# EAGLE design z80sim_pio_3_board2_v2 (EAGLE 9.6.2)

## Sheet 1 of 2
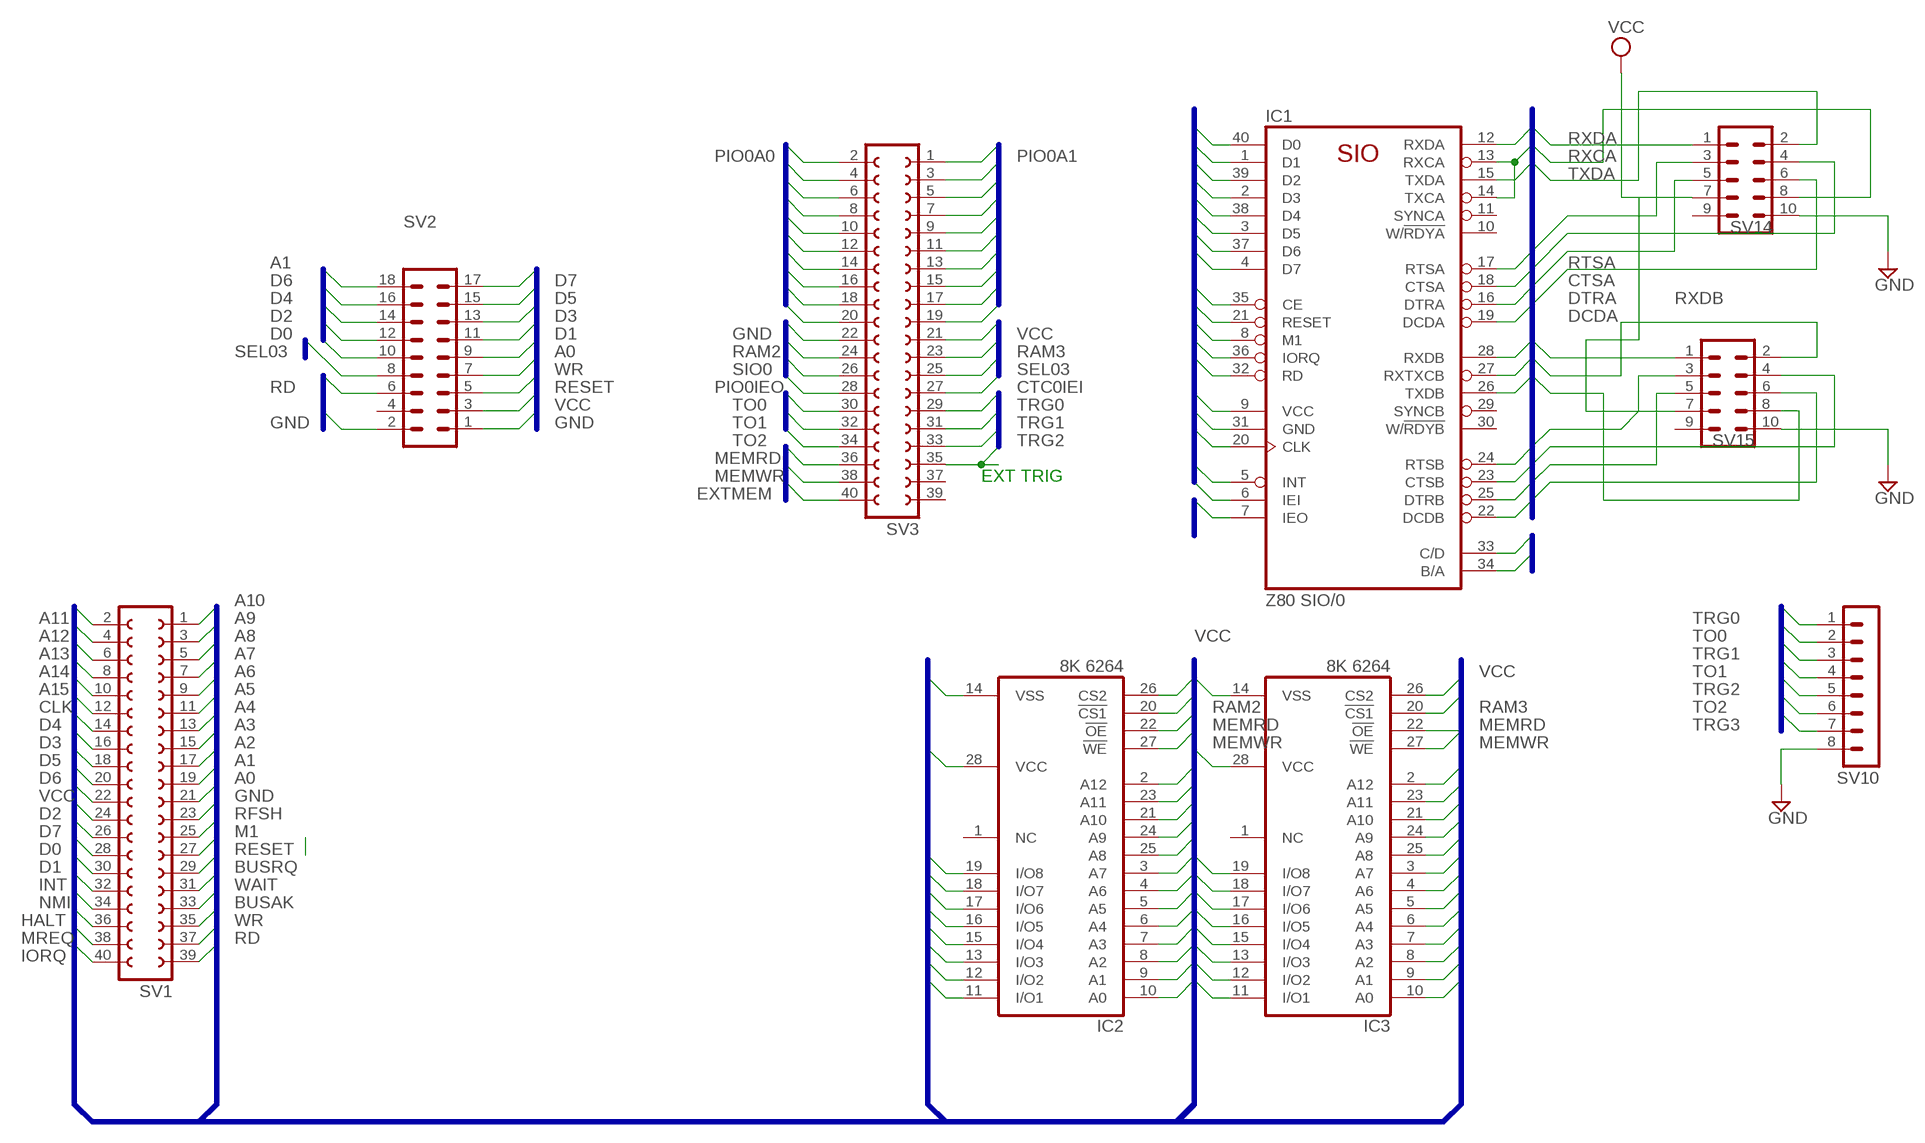
[diagram p0: schematic, sheet 1]

### Parts
IC1  Z80 SIO/0  Z80SIO  [DIL40]
IC2  8K 6264  6264A  [DIL28-6]
IC3  8K 6264  6264A  [DIL28-6]
SV1  FE20-2  [FE20-2]
SV2  MA09-2  [MA09-2]
SV3  FE20-2  [FE20-2]
SV10  MA08-1  [MA08-1]
SV14  MA05-2  [MA05-2]
SV15  MA05-2  [MA05-2]

### Nets
A0: IC1.34(B/A) IC2.10(A0) IC3.10(A0) SV1.21 SV2.9
A1: IC1.33(C/D) IC2.9(A1) IC3.9(A1) SV1.19 SV2.18
A2: IC2.8(A2) IC3.8(A2) SV1.17
A3: IC2.7(A3) IC3.7(A3) SV1.15
A4: IC2.6(A4) IC3.6(A4) SV1.13
A5: IC2.5(A5) IC3.5(A5) SV1.11
A6: IC2.4(A6) IC3.4(A6) SV1.9
A7: IC2.3(A7) IC3.3(A7) SV1.7
A8: IC2.25(A8) IC3.25(A8) SV1.5
A9: IC2.24(A9) IC3.24(A9) SV1.3
A10: IC2.21(A10) IC3.21(A10) SV1.1
A11: IC2.23(A11) IC3.23(A11) SV1.2
A12: IC2.2(A12) IC3.2(A12) SV1.4
A13: SV1.6
A14: SV1.8
A15: SV1.10
BUSAK: SV1.35
BUSRQ: SV1.31
CLK: IC1.20(CLK) SV1.12
CTC0IEI: IC1.7(IEO) SV3.27 ; also sheet 2
CTSA: IC1.18(CTSA) SV14.4
CTSB: IC1.23(CTSB) SV15.4
D0: IC1.40(D0) IC2.11(I/O1) IC3.11(I/O1) SV1.28 SV2.10
D1: IC1.1(D1) IC2.12(I/O2) IC3.12(I/O2) SV1.30 SV2.11
D2: IC1.39(D2) IC2.13(I/O3) IC3.13(I/O3) SV1.24 SV2.12
D3: IC1.2(D3) IC2.15(I/O4) IC3.15(I/O4) SV1.16 SV2.13
D4: IC1.38(D4) IC2.16(I/O5) IC3.16(I/O5) SV1.14 SV2.14
D5: IC1.3(D5) IC2.17(I/O6) IC3.17(I/O6) SV1.18 SV2.15
D6: IC1.37(D6) IC2.18(I/O7) IC3.18(I/O7) SV1.20 SV2.16
D7: IC1.4(D7) IC2.19(I/O8) IC3.19(I/O8) SV1.26 SV2.17
DCDA: IC1.19(DCDA) SV14.6
DCDB: IC1.22(DCDB) SV15.6
DTRA: IC1.16(DTRA) SV14.5
DTRB: IC1.25(DTRB) SV15.5
EXTMEM: SV3.40
GND: IC1.31(GND) IC2.14(VSS) IC3.14(VSS) SV1.23 SV2.1 SV2.2 SV3.22 SV10.8 SV14.10 SV15.10 ; also sheet 2
HALT: SV1.36
INT: IC1.5(INT) SV1.32
IORQ: IC1.36(IORQ) SV1.40
M1: IC1.8(M1) SV1.27
MEMRD: IC2.22(!OE) IC3.22(!OE) SV3.36
MEMWR: IC2.27(!WE) IC3.27(!WE) SV3.38
MREQ: SV1.38
NMI: SV1.34
PIO0A0: SV3.2 ; also sheet 2
PIO0A1: SV3.1 ; also sheet 2
PIO0A2: SV3.4 ; also sheet 2
PIO0A3: SV3.3 ; also sheet 2
PIO0A4: SV3.6 ; also sheet 2
PIO0A5: SV3.5 ; also sheet 2
PIO0A6: SV3.8 ; also sheet 2
PIO0A7: SV3.7 ; also sheet 2
PIO0ARDY: SV3.10 ; also sheet 2
PIO0ASTB: SV3.9 ; also sheet 2
PIO0B0: SV3.12 ; also sheet 2
PIO0B1: SV3.11 ; also sheet 2
PIO0B2: SV3.14 ; also sheet 2
PIO0B3: SV3.13 ; also sheet 2
PIO0B4: SV3.16 ; also sheet 2
PIO0B5: SV3.15 ; also sheet 2
PIO0B6: SV3.18 ; also sheet 2
PIO0B7: SV3.17 ; also sheet 2
PIO0BRDY: SV3.20 ; also sheet 2
PIO0BSTB: SV3.19 ; also sheet 2
PIO0IEO: SV3.28
RAM2: IC2.20(!CS1) SV3.24
RAM3: IC3.20(!CS1) SV3.23
RD: IC1.32(RD) SV1.39 SV2.6
RESET: IC1.21(RESET) SV1.29 SV2.5
RFSH: SV1.25
RTSA: IC1.17(RTSA) SV14.3
RTSB: IC1.24(RTSB) SV15.3
RXCA: IC1.13(RXCA) IC1.14(TXCA) SV14.8 ; also sheet 2
RXDA: IC1.12(RXDA) SV14.1
RXDB: IC1.28(RXDB) SV15.1
RXTXCB: IC1.27(RXTXCB) SV15.8 ; also sheet 2
SEL03: SV2.8 SV3.25
SIO0: IC1.35(CE) SV3.26
TO0: SV3.30 SV10.2 ; also sheet 2
TO1: SV3.32 SV10.4 ; also sheet 2
TO2: SV3.34 SV10.6
TRG0: SV3.29 SV10.1
TRG1: SV3.31 SV10.3
TRG2: SV3.33 SV10.5
TRG3: SV3.35 SV10.7
TXDA: IC1.15(TXDA) SV14.2
TXDB: IC1.26(TXDB) SV15.2
VCC: IC1.6(IEI) IC1.9(VCC) IC2.26(CS2) IC2.28(VCC) IC3.26(CS2) IC3.28(VCC) SV1.22 SV2.3 SV3.21 SV14.7 SV15.7 ; also sheet 2
WAIT: SV1.33
WR: SV1.37 SV2.7
Unconnected: IC1.10(W/!RDYA) IC1.11(SYNCA) IC1.29(SYNCB) IC1.30(W/!RDYB) IC2.1(NC) IC3.1(NC) SV2.4 SV3.37 SV3.39 SV14.9 SV15.9

### Buses
M1,MREQ,IORQ,RD,WR,RFSH,HALT,WAIT,INT,NMI,RESET,BUSRQ,BUSAK,CLK,GND,VCC,A[0..15],D[0..7],MEMRD,MEMWR,IORD,IOWR,ROM0,RAM1,RAM2,RAM3,PIO0,CTC0,CTC0IEO,PIO0IEO,SIO0,SIO0IEO,SEL03,32K_SEL,ALT_BOOT
CTC0TO0,CTC0TO1,CTC0TO2,CTC0TRG0,CTC0TRG1,CTC0TRG2,CTC0TRG3,PIO0A0,PIO0A1,PIO0A2,PIO0A3,PIO0A4,PIO0A5,PIO0A6,PIO0A7,PIO0ARDY,PIO0ASTB,PIO0B0,PIO0B1,PIO0B2,PIO0B3,PIO0B4,PIO0B5,PIO0B6,PIO0B7,PIO0BRDY,PIO0BSTB
M1,MREQ,IORQ,RD,WR,RFSH,HALT,WAIT,INT,NMI,RESET,BUSRQ,BUSAK,CLK,GND,VCC,A[0..15],D[0..7],MEMRD,MEMWR,IORD,IOWR,ROM0,RAM1,RAM2,RAM3,PIO0,CTC0,CTC0IEO,CTC0IEI,PIO0IEO,SIO0,SEL03,EXTMEM
TRG0,TO0,TRG1,TO1,TRG2,TO2,TRG3
RXDA,RXCA,TXDA,TXCA,RTSA,CTSA,DTRA,DCDA,RXDB,RXTXCB,TXDB,RTSB,CTSB,DTRB,DCDB

### Notes on the sheet
- EXT TRIG

## Sheet 2 of 2
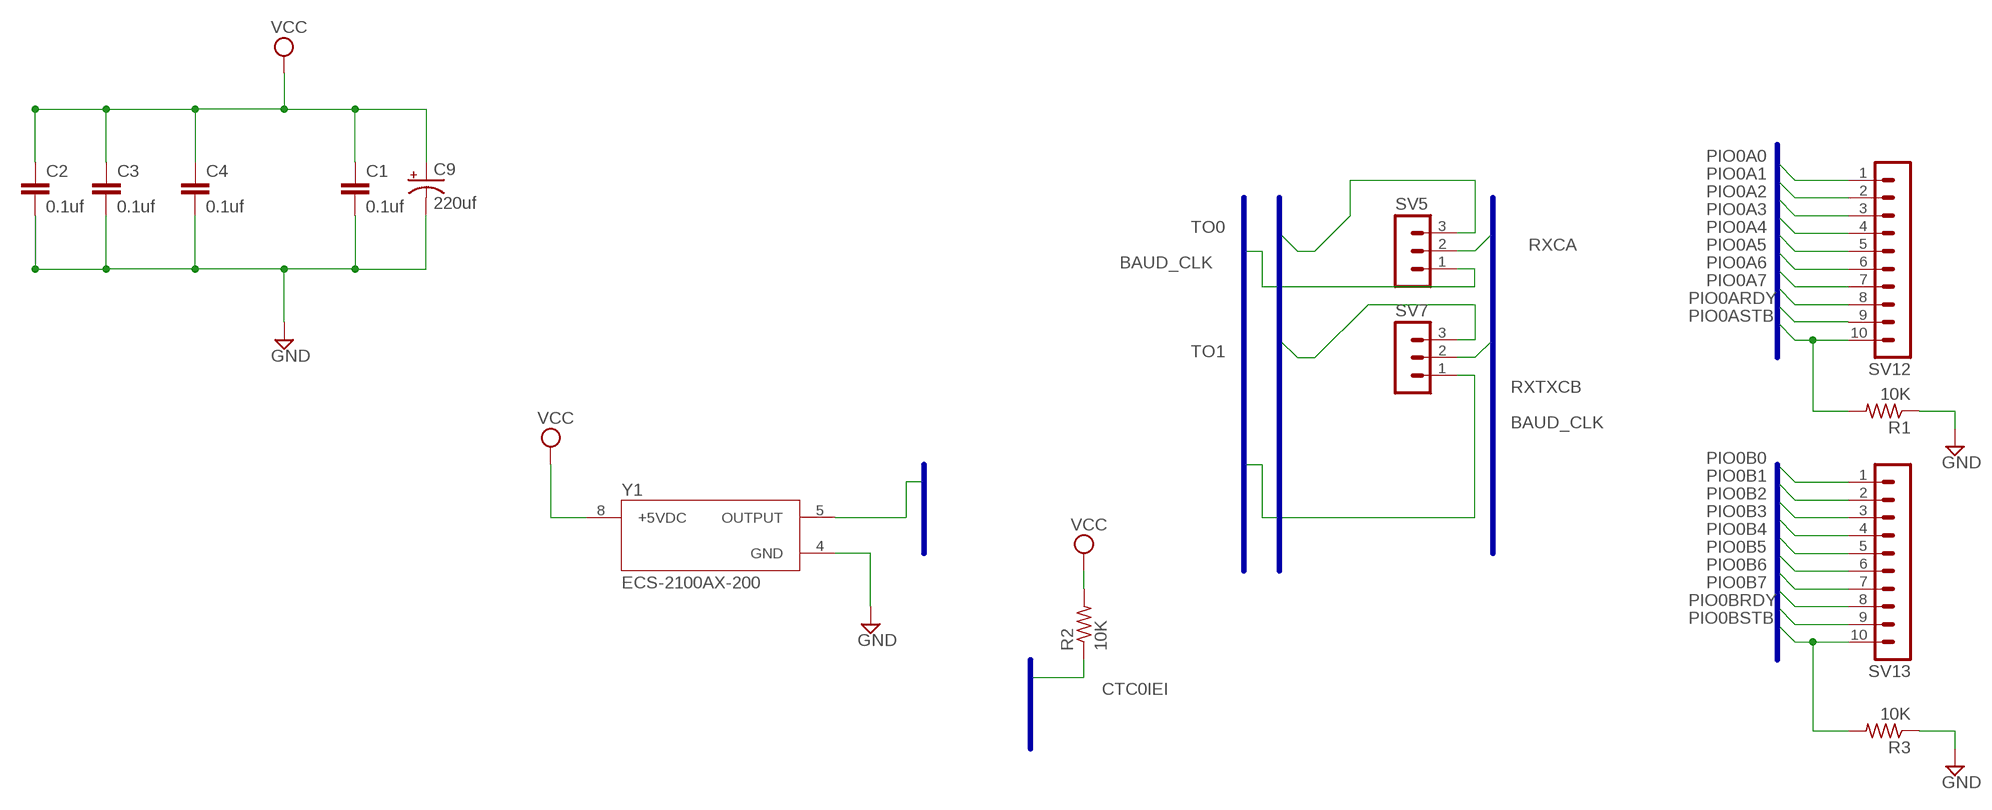
[diagram p1: schematic, sheet 2]

### Parts
C1  0.1uf  C5/3  [C5B3]
C2  0.1uf  C5/3  [C5B3]
C3  0.1uf  C5/3  [C5B3]
C4  0.1uf  C5/3  [C5B3]
C9  220uf  CPOL-USE3.5-10  [E3,5-10]
R1  10K  R-US_0204/7  [0204/7]
R2  10K  R-US_0204/7  [0204/7]
R3  10K  R-US_0204/7  [0204/7]
SV5  MA03-1  [MA03-1]
SV7  MA03-1  [MA03-1]
SV12  MA10-1  [MA10-1]
SV13  MA10-1  [MA10-1]
Y1  ECS-2100AX-200  [ECS-2100AX-200]

### Nets
BAUD_CLK: SV5.1 SV7.1 Y1.5(OUTPUT)
CTC0IEI: R2.1 ; also sheet 1
GND: C1.2 C2.2 C3.2 C4.2 C9.- R1.1 R3.1 Y1.4(GND) ; also sheet 1
PIO0A0: SV12.1 ; also sheet 1
PIO0A1: SV12.2 ; also sheet 1
PIO0A2: SV12.3 ; also sheet 1
PIO0A3: SV12.4 ; also sheet 1
PIO0A4: SV12.5 ; also sheet 1
PIO0A5: SV12.6 ; also sheet 1
PIO0A6: SV12.7 ; also sheet 1
PIO0A7: SV12.8 ; also sheet 1
PIO0ARDY: SV12.9 ; also sheet 1
PIO0ASTB: R1.2 SV12.10 ; also sheet 1
PIO0B0: SV13.1 ; also sheet 1
PIO0B1: SV13.2 ; also sheet 1
PIO0B2: SV13.3 ; also sheet 1
PIO0B3: SV13.4 ; also sheet 1
PIO0B4: SV13.5 ; also sheet 1
PIO0B5: SV13.6 ; also sheet 1
PIO0B6: SV13.7 ; also sheet 1
PIO0B7: SV13.8 ; also sheet 1
PIO0BRDY: SV13.9 ; also sheet 1
PIO0BSTB: R3.2 SV13.10 ; also sheet 1
RXCA: SV5.2 ; also sheet 1
RXTXCB: SV7.2 ; also sheet 1
TO0: SV5.3 ; also sheet 1
TO1: SV7.3 ; also sheet 1
VCC: C1.1 C2.1 C3.1 C4.1 C9.+ R2.2 Y1.8(+5VDC) ; also sheet 1

### Buses
32K_SEL,A[0..15],ALT_BOOT,BAUD_CLK,BUSAK,BUSRQ,CLK,CTC0,CTC0IEO,D[0..7],EXTMEM,GND,HALT,INT,IORD,IORQ,IOWR,M1,MEMRD,MEMWR,MREQ,NMI,PIO0,PIO0A0,PIO0A1,PIO0A2,PIO0A3,PIO0A4,PIO0A5,PIO0A6,PIO0A7,PIO0ARDY,PIO0ASTB,PIO0B0,PIO0B1,PIO0B2,PIO0B3,PIO0B4,PIO0B5,PIO0B6,PIO0B7,PIO0BRDY,PIO0BSTB,PIO0IEO,RAM1,RAM2,RAM3,RD,RESET,RFSH,ROM0,SEL03,SIO0,SIO0IEO,VCC,WAIT,WR
M1,MREQ,IORQ,RD,WR,RFSH,HALT,WAIT,INT,NMI,RESET,BUSRQ,BUSAK,CLK,GND,VCC,A[0..15],D[0..7],MEMRD,MEMWR,IORD,IOWR,ROM0,RAM1,RAM2,RAM3,PIO0,CTC0,CTC0IEO,CTC0IEI,PIO0IEO,SIO0,SEL03,EXTMEM
TRG0,TO0,TRG1,TO1,TRG2,TO2,TRG3
RXDA,RXCA,TXDA,TXCA,RTSA,CTSA,DTRA,DCDA,RXDB,RXTXCB,TXDB,RTSB,CTSB,DTRB,DCDB

## Library data of the parts
C1-C4 = capacitor-wima:C: CAPACITOR naming: grid - package width
C9 = rcl:CPOL-US: POLARIZED CAPACITOR, American symbol
IC1 = zilog:Z80SIO: Z80 FAMILY DEVICE
IC2 IC3 = memory-hitachi:6264A: MEMORY; OC_FARNELL: 283605; OC_NEWARK: unknown
R1-R3 = resistor:R-US_: RESISTOR, American symbol
SV1 SV3 = con-lsta:FE20-2: FEMALE HEADER; OC_FARNELL: unknown; OC_NEWARK: unknown
SV2 = con-lstb:MA09-2: PIN HEADER; OC_FARNELL: unknown; OC_NEWARK: unknown
SV5 SV7 = con-lstb:MA03-1: PIN HEADER; OC_FARNELL: unknown; OC_NEWARK: unknown
SV10 = con-lstb:MA08-1: PIN HEADER; OC_FARNELL: unknown; OC_NEWARK: unknown
SV12 SV13 = con-lstb:MA10-1: PIN HEADER; OC_FARNELL: unknown; OC_NEWARK: unknown
SV14 SV15 = con-lstb:MA05-2: PIN HEADER; OC_FARNELL: unknown; OC_NEWARK: unknown
Y1 = Crystals_Oscillators:ECS-2100AX-200: XTAL OSC XO 20.0000MHZ HCMOS TTL Manufacturer's datasheet <https://ecsxtal.com/store/pdf/ecs-2100x.pdf>; CREATED_BY: PCBLayout.com; DIGIKEY_PART_NUMBER: X964-ND; MANUFACTURER: ECS Inc.; MPN: ECS-2100AX-200; PACKAGE: 8-DIP

## Board
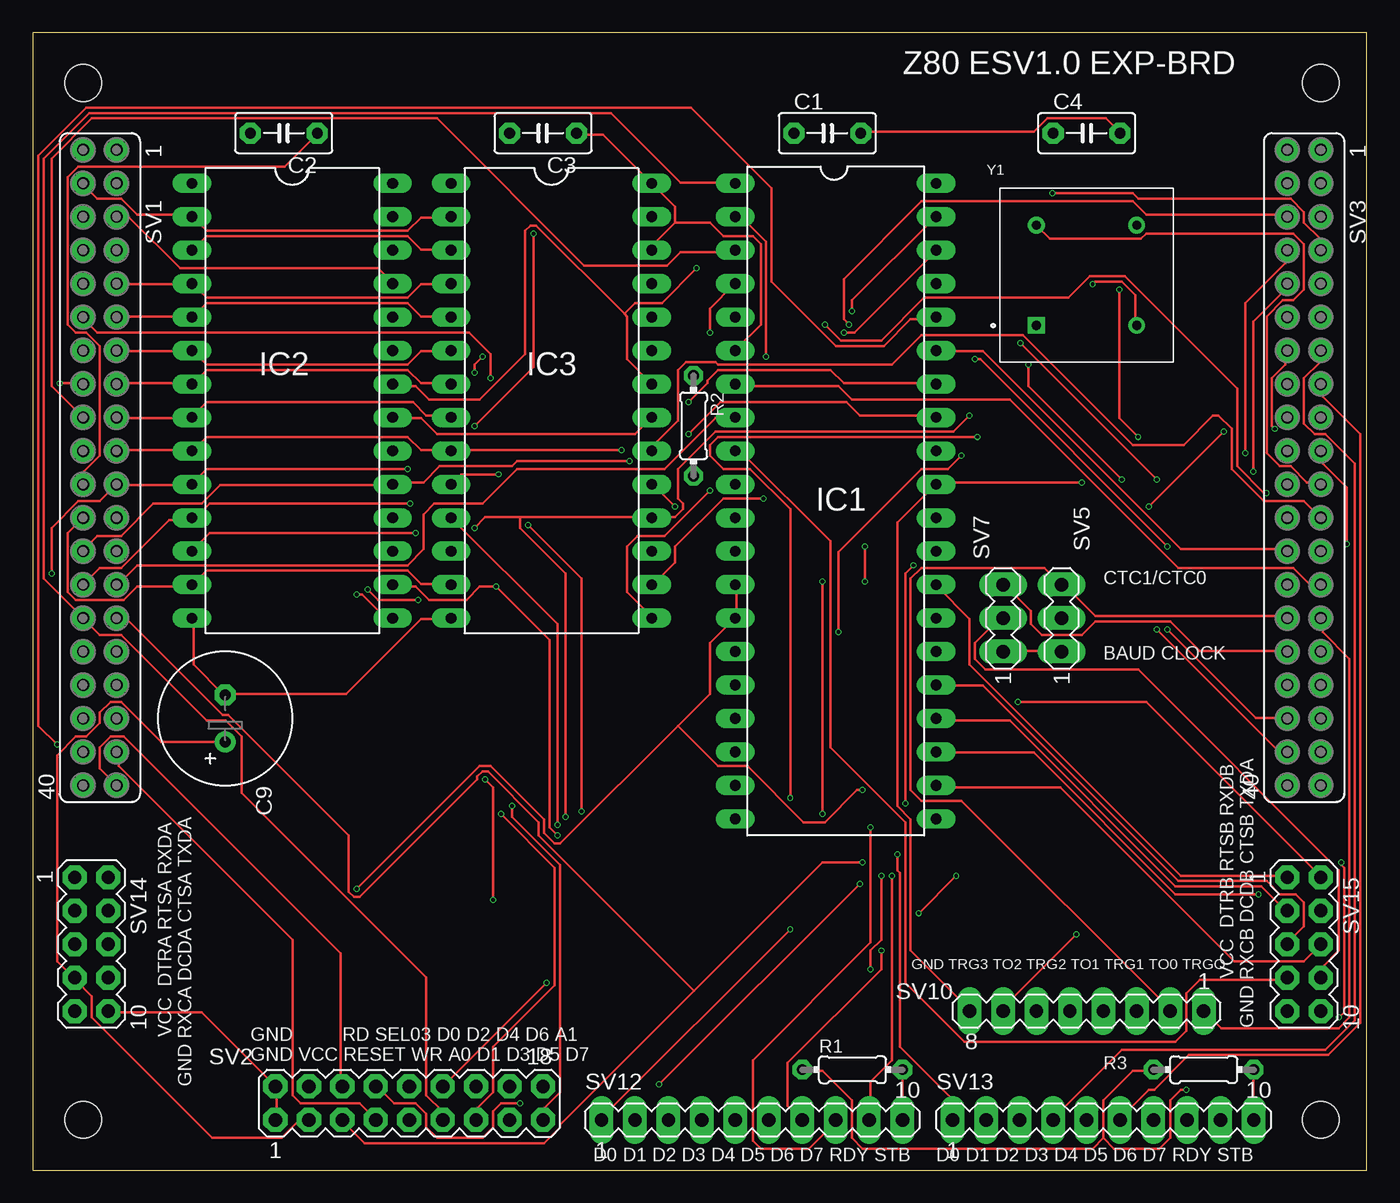
[diagram p2: board, top side]
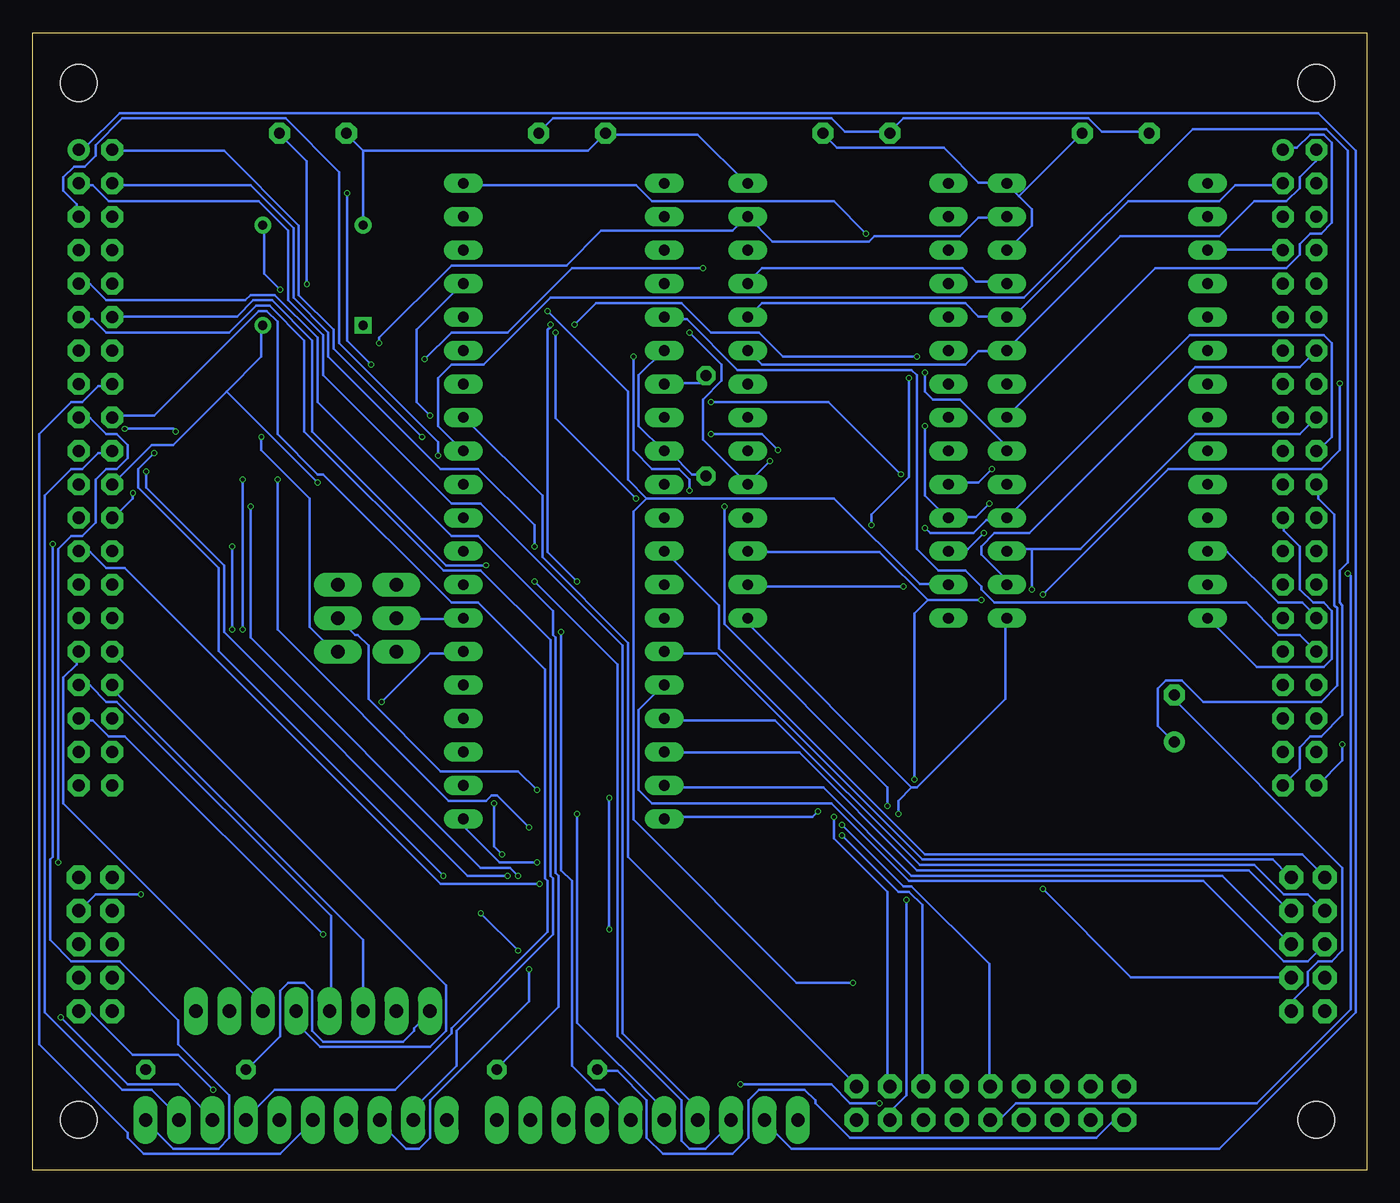
[diagram p3: board, bottom side, seen from below]

Size 101.27 x 86.35 mm. Coordinates in mm from the lower left corner, seen from the top.
Outline: 0,0 101.27,0 101.27,86.35 0,86.35 0,0
Copper layers (1*16): Top 0.035mm / dielectric 1.6mm / Bottom 0.035mm
Design rules "jlcpcb-2layers *": minimum track width 8mil, minimum drill 0.3mm, track to track 8mil, track to pad 8mil, pad to pad 8mil, via to via 8mil, smd to smd 5mil, copper to edge 0.3mm, drill to drill 8mil, minimum pad ring 10mil, minimum via ring 3mil, stop-mask expansion 4mil, vias tented up to drill 0mil, thermal gap 10mil
Holes 2.8 mm at 3.81,82.55 97.79,82.55 97.79,3.81 3.81,3.81

### Footprints (pad centres in the part's own frame; a part is rotated, then mirrored left to right if it is on the bottom)
C5B3 = drill 0.813 pad 1.6 octagon: 1 -2.54,0; 2 2.54,0
E3,5-10 = drill 0.813 pad 1.6: + -1.778,0 | drill 0.813 pad 1.6 octagon: - 1.778,0
DIL40 = drill 0.813 long: 1 -24.13,-7.62; 2 -21.59,-7.62; 3 -19.05,-7.62; 4 -16.51,-7.62; 5 -13.97,-7.62; 6 -11.43,-7.62; 7 -8.89,-7.62; 8 -6.35,-7.62; 9 -3.81,-7.62; 10 -1.27,-7.62; 11 1.27,-7.62; 12 3.81,-7.62; 13 6.35,-7.62; 14 8.89,-7.62; 15 11.43,-7.62; 16 13.97,-7.62; 17 16.51,-7.62; 18 19.05,-7.62; 19 21.59,-7.62; 20 24.13,-7.62; 21 24.13,7.62; 22 21.59,7.62; 23 19.05,7.62; 24 16.51,7.62; 25 13.97,7.62; 26 11.43,7.62; 27 8.89,7.62; 28 6.35,7.62; 29 3.81,7.62; 30 1.27,7.62; 31 -1.27,7.62; 32 -3.81,7.62; 33 -6.35,7.62; 34 -8.89,7.62; 35 -11.43,7.62; 36 -13.97,7.62; 37 -16.51,7.62; 38 -19.05,7.62; 39 -21.59,7.62; 40 -24.13,7.62
DIL28-6 = drill 0.813 long: 1 -16.51,-7.62; 2 -13.97,-7.62; 3 -11.43,-7.62; 4 -8.89,-7.62; 5 -6.35,-7.62; 6 -3.81,-7.62; 7 -1.27,-7.62; 8 1.27,-7.62; 9 3.81,-7.62; 10 6.35,-7.62; 11 8.89,-7.62; 12 11.43,-7.62; 13 13.97,-7.62; 14 16.51,-7.62; 15 16.51,7.62; 16 13.97,7.62; 17 11.43,7.62; 18 8.89,7.62; 19 6.35,7.62; 20 3.81,7.62; 21 1.27,7.62; 22 -1.27,7.62; 23 -3.81,7.62; 24 -6.35,7.62; 25 -8.89,7.62; 26 -11.43,7.62; 27 -13.97,7.62; 28 -16.51,7.62
0204/7 = drill 0.813 octagon: 1 -3.81,0; 2 3.81,0
FE20-2 = drill 0.914: 1 -24.13,1.27 | drill 0.914 octagon: 2 -24.13,-1.27; 3 -21.59,1.27; 4 -21.59,-1.27; 5 -19.05,1.27; 6 -19.05,-1.27; 7 -16.51,1.27; 8 -16.51,-1.27; 9 -13.97,1.27; 10 -13.97,-1.27; 11 -11.43,1.27; 12 -11.43,-1.27; 13 -8.89,1.27; 14 -8.89,-1.27; 15 -6.35,1.27; 16 -6.35,-1.27; 17 -3.81,1.27; 18 -3.81,-1.27; 19 -1.27,1.27; 20 -1.27,-1.27; 21 1.27,1.27; 22 1.27,-1.27; 23 3.81,1.27; 24 3.81,-1.27; 25 6.35,1.27; 26 6.35,-1.27; 27 8.89,1.27; 28 8.89,-1.27; 29 11.43,1.27; 30 11.43,-1.27; 31 13.97,1.27; 32 13.97,-1.27; 33 16.51,1.27; 34 16.51,-1.27; 35 19.05,1.27; 36 19.05,-1.27; 37 21.59,1.27; 38 21.59,-1.27; 39 24.13,1.27; 40 24.13,-1.27
MA09-2 = drill 1.016 octagon: 1 -10.16,-1.27; 2 -10.16,1.27; 3 -7.62,-1.27; 4 -7.62,1.27; 5 -5.08,-1.27; 6 -5.08,1.27; 7 -2.54,-1.27; 8 -2.54,1.27; 9 0,-1.27; 10 0,1.27; 11 2.54,-1.27; 12 2.54,1.27; 13 5.08,-1.27; 14 5.08,1.27; 15 7.62,-1.27; 16 7.62,1.27; 17 10.16,-1.27; 18 10.16,1.27
MA03-1 = drill 1.016 long: 1 -2.54,0; 2 0,0; 3 2.54,0
MA08-1 = drill 1.016 long: 1 -8.89,0; 2 -6.35,0; 3 -3.81,0; 4 -1.27,0; 5 1.27,0; 6 3.81,0; 7 6.35,0; 8 8.89,0
MA10-1 = drill 1.016 long: 1 -11.43,0; 2 -8.89,0; 3 -6.35,0; 4 -3.81,0; 5 -1.27,0; 6 1.27,0; 7 3.81,0; 8 6.35,0; 9 8.89,0; 10 11.43,0
MA05-2 = drill 1.016 octagon: 1 -5.08,-1.27; 2 -5.08,1.27; 3 -2.54,-1.27; 4 -2.54,1.27; 5 0,-1.27; 6 0,1.27; 7 2.54,-1.27; 8 2.54,1.27; 9 5.08,-1.27; 10 5.08,1.27
ECS-2100AX-200 = drill 0.7 square: 1 -3.81,-3.81 | drill 0.7: 4 3.81,-3.81; 5 3.81,3.81; 8 -3.81,3.81

### Placement (x,y rotation side)
C1  60.33,78.74 0 top
C2  19.05,78.74 180 top
C3  38.73,78.74 180 top
C4  80.01,78.74 0 top
C9  14.61,34.29 90 top
IC1  60.96,50.8 270 top
IC2  19.68,58.42 270 top
IC3  39.37,58.42 270 top
R1  62.23,7.62 0 top
R2  50.16,56.52 270 top
R3  88.9,7.62 0 top
SV1  5.08,53.34 270 top
SV2  28.57,5.08 0 top
SV3  96.52,53.34 270 top
SV5  78.11,41.91 90 top
SV7  73.66,41.91 90 top
SV10  80.01,12.06 180 top
SV12  54.61,3.81 0 top
SV13  81.28,3.81 0 top
SV14  4.45,17.14 270 top
SV15  96.52,17.14 270 top
Y1  80.01,67.94 0 top

### Tracks (layer width: path | path; a pad name or v marks a point on that pad's centre or on a via)
A0  (via drill 0.3)
  Top 0.203: v28.45,53.24 13.21,53.24 12.19,52.22 IC2.10 11.99,52.02 6.5,52.02 SV1.21 5.08,50.8 3.45,50.8 1.42,48.77 v1.42,45.31 | v49.78,58.32 51.21,59.74 51.21,59.94 52.02,60.76 60.55,60.76 61.57,59.74 68.48,59.74 IC1.34 | v35.36,52.83 32.51,52.83 IC3.10
  Bottom 0.203: v28.45,53.24 29.46,52.22 31.7,52.22 IC3.10 | v49.78,58.32 40.84,58.32 v35.36,52.83 | v1.42,45.31 1.22,45.11 1.22,12.19 8.33,5.08 26.62,5.08 27.84,3.86 28.45,3.86 SV2.9
A1  (via drill 0.3)
  Top 0.203: SV1.19 6.5,54.66 11.99,54.66 IC2.9 12.19,54.66 13.21,55.68 28.45,55.68 29.46,54.66 31.7,54.66 IC3.9 31.9,54.66 v44.7,54.66 | v49.78,55.88 52.22,58.32 61.77,58.32 62.79,57.3 68.48,57.3 IC1.33
  Bottom 0.203: IC1.33 68.48,57.1 62.59,51.21 62.59,46.53 56.08,40.03 56.08,23.77 38.81,6.5 SV2.18 | v44.7,54.66 45.92,55.88 v49.78,55.88
A2
  Top 0.203: SV1.17 6.5,57.1 11.99,57.1 IC2.8 12.19,57.3 13.21,58.32 28.85,58.32 29.87,57.3 31.7,57.3 IC3.8
A3
  Top 0.203: SV1.15 6.5,59.74 11.99,59.74 IC2.7 12.19,59.74 13.21,60.76 28.45,60.76 29.46,59.74 31.7,59.74 IC3.7
A4
  Top 0.203: SV1.13 6.5,62.18 11.99,62.18 IC2.6 12.19,62.18 13.21,61.16 28.45,61.16 29.46,62.18 31.7,62.18 IC3.6
A5
  Top 0.203: SV1.11 6.5,64.82 11.99,64.82 IC2.5 12.19,64.82 13.21,65.84 28.45,65.84 29.46,64.82 31.7,64.82 IC3.5
A6
  Top 0.203: SV1.9 6.5,67.26 11.99,67.26 IC2.4 12.19,67.26 13.21,66.24 28.45,66.24 29.46,67.26 31.7,67.26 IC3.4
A7
  Top 0.203: IC3.3 31.7,69.9 29.46,69.9 28.45,70.92 13.21,70.92 12.19,69.9 IC2.3
  Bottom 0.203: IC2.3 11.99,69.9 6.5,69.9 SV1.7
A8
  Top 0.203: SV1.5 6.5,72.34 7.32,72.34 11.18,68.48 26.21,68.48 27.23,67.46 IC2.25
  Bottom 0.203: IC2.25 27.43,67.46 29.67,67.46 30.68,68.48 45.92,68.48 46.94,67.46 IC3.25
A9
  Bottom 0.203: IC3.24 45.92,65.84 30.48,65.84 29.46,64.82 27.43,64.82 IC2.24 27.23,64.82 26.82,64.82 18.09,73.56 11.18,73.56 9.96,74.78 6.5,74.78 SV1.3
A10
  Top 0.203: IC3.21 45.72,55.88 30.68,55.88 29.46,57.1 27.43,57.1 IC2.21
  Bottom 0.203: SV1.1 6.3,77.62 5.28,77.62 4.27,78.64 3.25,78.64 2.64,78.03 2.64,71.93 3.45,71.12 4.27,71.12 5.08,70.31 5.08,69.49 6.1,68.48 16.05,68.48 27.23,57.3 IC2.21
A11
  Bottom 0.203: IC3.23 45.92,61.16 30.48,61.16 29.46,62.18 27.43,62.18 IC2.23 27.23,62.38 18.69,70.92 11.18,70.92 8.53,73.56 6.1,73.56 5.08,74.57 5.08,75.39 3.86,76.61 3.86,77.42 SV1.2
A12
  Top 0.203: SV1.4 3.86,74.78 4.88,73.76 6.71,73.76 7.92,72.54 11.99,72.54 IC2.2 12.19,72.34 13.21,71.32 28.45,71.32 29.46,72.34 31.7,72.34 IC3.2
BAUD_CLK  (via drill 0.3)
  Top 0.203: v82.5,66.85 82.5,57.1 v83.92,55.68 | SV7.1 73.76,39.42 78.03,39.42 SV5.1
  Bottom 0.203: v82.5,66.85 83.72,68.07 83.72,71.73 Y1.5 | v83.92,55.68 83.92,54.66 80.26,51 80.26,41.25 78.23,39.22 SV5.1
CLK  (via drill 0.3)
  Top 0.203: v41.66,27.23 41.66,44.91 v37.59,48.97 | v34.75,60.15 34.75,61.98 33.12,63.6 4.88,63.6 3.86,64.62 SV1.12
  Bottom 0.203: v41.66,27.23 42.06,26.82 53.24,26.82 IC1.20 | v37.59,48.97 37.59,49.78 34.75,52.63 v34.75,60.15
CTC0IEI
  Top 0.203: SV3.27 97.74,44.5 96.93,44.5 95.71,45.72 86.97,45.72 74.17,58.52 62.18,58.52 61.16,59.54 53.44,59.54 IC1.7
  Bottom 0.203: IC1.7 53.24,59.74 50.6,59.74 50.19,60.15 R2.1
CTSA
  Bottom 0.203: IC1.18 53.24,31.7 43.08,31.7 34.14,22.76 8.94,22.76 5.89,19.71 SV14.4
CTSB  (via drill 0.3)
  Top 0.203: v93.07,20.93 86.77,20.93 76,31.7 68.68,31.7 IC1.23
  Bottom 0.203: v93.07,20.93 96.52,20.93 97.74,19.71 SV15.4
D0  (via drill 0.3)
  Top 0.203: SV1.28 5.08,45.72 6.71,45.72 10.36,49.38 11.99,49.38 IC2.11 12.19,49.38 13.41,50.6 v28.65,50.6 | v38,71.12 38,60.96 v33.53,56.49 | v39.83,26.21 39.83,41.45 IC3.11
  Bottom 0.203: v28.65,50.6 29.67,49.58 31.7,49.58 IC3.11 31.9,49.58 33.53,51.21 v33.53,56.49 | v38,71.12 40.44,73.56 54.25,73.56 55.47,74.78 68.48,74.78 IC1.40 | v39.83,26.21 35.15,21.54 34.54,21.54 28.65,15.65 28.65,6.5 SV2.10
D1  (via drill 0.3)
  Top 0.203: v29.06,48.36 13.41,48.36 12.19,47.14 IC2.12 | IC1.1 53.24,74.98 49.17,74.98 43.89,80.26 4.27,80.26 0.81,76.81 0.81,44.91 SV1.30 5.08,40.64 6.71,40.64 13.21,34.14 14.63,34.14 15.85,32.92 15.85,28.65 29.87,14.63 29.87,5.69 31.09,4.47 31.09,3.86 SV2.11
  Bottom 0.203: IC2.12 11.99,46.94 10.57,46.94 6.71,43.08 4.88,43.08 3.86,42.06 SV1.30 | v29.06,48.36 30.28,47.14 31.7,47.14 IC3.12
D2  (via drill 0.3)
  Top 0.203: SV1.24 2.64,48.36 2.64,43.89 3.25,43.28 6.91,43.28 7.92,44.3 11.99,44.3 IC2.13 12.19,44.5 13.21,45.52 28.45,45.52 29.46,44.5 31.7,44.5 IC3.13 | v62.18,65.23 62.18,66.04 68.48,72.34 IC1.39 | v39.01,14.22 31.29,6.5 SV2.12
  Bottom 0.203: v62.18,65.23 56.08,59.13 56.08,52.43 54.66,51 | 54.66,51 40.44,51 33.93,44.5 31.9,44.5 IC3.13 | v39.01,14.22 43.28,14.22 55.68,26.62 55.68,49.99 54.66,51
D3  (via drill 0.3)
  Top 0.203: v55.68,61.77 55.68,70.51 53.85,72.34 53.44,72.34 IC1.2 | v51.41,51.61 47.95,48.16 45.92,48.16 45.11,47.35 45.11,43.89 46.94,42.06 IC3.15 | v2.03,59.74 3.66,59.74 SV1.16 | v24.59,43.69 24.99,43.69 26.62,42.06 27.23,42.06 IC2.15 | v35.56,27.03 39.62,22.96 39.62,14.02 34.95,9.35 34.95,5.89 33.73,4.67 33.73,3.86 SV2.13
  Bottom 0.203: 34.54,29.06 34.14,29.06 27.43,35.76 27.43,41.86 IC2.15 | 34.54,29.06 46.94,41.45 46.94,41.86 IC3.15 | v55.68,61.77 55.68,54.66 54.25,53.24 52.22,53.24 51.41,52.43 v51.41,51.61 | v2.03,59.74 2.03,54.66 3.45,53.24 15.04,53.24 v24.59,43.69 | v35.56,27.03 35.56,28.04 34.54,29.06
D4  (via drill 0.3)
  Top 0.203: IC2.16 27.43,44.3 29.06,44.3 30.07,43.28 32.92,43.28 33.93,44.3 v35.15,44.3 39.22,40.23 39.22,26.01 v39.83,25.4 | v61.57,63.6 62.38,63.6 68.48,69.7 IC1.38 | v55.47,51 52.43,51 48.77,47.35 48.77,46.13 47.14,44.5 IC3.16
  Bottom 0.203: SV1.14 5.08,60.96 13.01,60.96 25.6,48.36 28.25,48.36 29.26,47.35 29.26,46.74 27.43,44.91 27.43,44.5 IC2.16 | v35.15,44.3 46.94,44.3 IC3.16 | v61.57,63.6 61.57,57.1 v55.47,51 | v39.83,25.4 35.56,21.13 34.75,21.13 33.73,20.12 33.73,6.5 SV2.14
D5  (via drill 0.3)
  Top 0.203: v29.26,43.28 26.21,43.28 v25.4,44.09 | SV1.18 1.42,59.54 1.42,76.81 4.47,79.86 30.68,79.86 41.86,68.68 48.16,68.68 49.17,69.7 53.24,69.7 IC1.3 | v34.95,20.52 34.95,29.06 v34.34,29.67
  Bottom 0.203: 25.4,47.14 21.74,47.14 13.01,55.88 5.08,55.88 SV1.18 | 25.4,47.14 27.23,47.14 IC2.17 | 33.33,43.28 36.98,46.94 46.94,46.94 IC3.17 | v29.26,43.28 33.33,43.28 | 25.4,47.14 v25.4,44.09 | v34.95,20.52 34.95,5.69 36.17,4.47 36.17,3.86 SV2.15 | v34.34,29.67 34.34,42.27 33.33,43.28
D6  (via drill 0.3)
  Top 0.203: 36.98,49.58 34.34,49.58 v33.53,48.77 | 36.98,49.58 46.94,49.58 IC3.18 47.14,49.58 48.77,49.58 49.38,50.19 49.38,50.6 48.97,51 48.97,53.24 51.82,56.08 69.9,56.08 v71.12,57.3 | v40.44,26.82 40.44,45.31 36.98,48.77 36.98,49.58
  Bottom 0.203: SV1.20 3.66,54.66 2.64,55.68 2.64,62.79 3.25,63.4 13.41,63.4 27.23,49.58 IC2.18 27.43,49.38 28.85,49.38 29.87,48.36 33.12,48.36 v33.53,48.77 | v71.12,57.3 72.14,58.32 72.14,63.8 68.68,67.26 IC1.37 | v40.44,26.82 40.44,25.2 36.37,21.13 36.37,6.5 SV2.16
D7  (via drill 0.3)
  Top 0.203: SV1.26 3.86,47.14 4.88,48.16 6.71,48.16 9.14,50.6 12.8,50.6 14.22,52.02 27.23,52.02 IC2.19 27.43,52.22 29.67,52.22 30.89,53.44 36.37,53.44 36.78,53.85 v45.31,53.85 | v51.41,63.6 51.41,65.43 53.24,67.26 IC1.4 | v36.37,27.64 36.37,26.82 40.03,23.16 40.03,5.89 38.81,4.67 38.81,3.86 SV2.17 | v48.77,50.39 47.14,52.02 IC3.19
  Bottom 0.203: v51.41,63.6 48.97,61.16 48.97,59.94 50.39,58.52 50.39,55.47 IC3.19 46.94,52.22 v45.31,53.85 | v36.37,27.64 36.37,29.06 48.77,41.45 v48.77,50.39
DCDA
  Bottom 0.203: IC1.19 53.24,29.06 41.25,29.06 34.54,22.35 10.97,22.35 5.89,17.27 SV14.6
DCDB
  Top 0.203: IC1.22 68.68,29.06 78.03,29.06 91.24,15.85 96.52,15.85 97.74,17.07 SV15.6
DTRA
  Bottom 0.203: SV14.5 4.47,15.85 6.3,15.85 12.39,21.95 34.75,21.95 40.64,27.84 54.25,27.84 55.27,28.85 55.27,34.95 53.44,36.78 IC1.16
DTRB
  Top 0.203: IC1.25 68.68,36.78 72.14,36.78 86.97,21.95 93.67,21.95 94.69,20.93 95.91,20.93 96.52,20.32 96.52,18.49 95.3,17.27 SV15.5
GND  (via drill 0.3)
  Top 0.203: C1.2 62.99,78.84 76,78.84 77.01,79.86 81.48,79.86 82.5,78.84 C4.2 | v80.47,67.26 80.67,67.46 82.7,67.46 83.72,66.45 83.72,64.21 Y1.4 | SV2.1 18.49,3.86 18.49,6.3 SV2.2 18.29,6.5 12.8,11.99 5.89,11.99 SV14.10 | IC2.14 12.19,41.86 12.19,38.41 14.43,36.17 C9.- 14.63,36.17 23.77,36.17 29.46,41.86 31.7,41.86 IC3.14 | SV10.8 71.12,12.19 66.65,16.66 66.65,26.62 65.63,27.64 65.63,49.17 68.48,52.02 IC1.31 68.68,52.22 v79.65,52.22 | 81.28,2.44 80.47,1.63 62.99,1.63 62.18,2.44 62.18,5.28 59.94,7.52 58.52,7.52 R1.1 | 81.28,2.44 81.28,5.28 83.52,7.52 84.94,7.52 R3.1 | v87.58,6.1 87.17,6.1 86.36,5.28 86.36,2.44 85.55,1.63 82.09,1.63 81.28,2.44
  Bottom 0.203: 86.56,59.13 90.63,55.07 92.25,55.07 SV3.22 | 86.56,59.13 83.92,61.77 83.92,64.01 Y1.4 | C2.2 16.66,78.84 20.12,78.84 21.13,79.86 35.15,79.86 36.17,78.84 C3.2 36.37,78.84 39.62,78.84 40.64,79.86 61.77,79.86 62.79,78.84 C1.2 | v80.47,67.26 80.47,76.61 82.5,78.64 C4.2 | SV1.23 6.3,49.38 6.3,48.56 5.08,47.35 5.08,44.09 4.06,43.08 3.25,43.08 2.64,42.47 2.64,38.81 3.25,38.2 8.33,38.2 11.99,41.86 IC2.14 | SV14.10 5.69,12.19 5.69,12.8 4.47,14.02 4.47,15.04 3.66,15.85 2.64,15.85 1.83,16.66 1.83,22.96 14.43,35.56 14.43,35.97 C9.- | v87.58,6.1 90.22,8.74 93.67,8.74 96.93,11.99 97.74,11.99 SV15.10 | SV10.8 71.12,11.99 72.34,10.77 72.34,10.57 73.15,9.75 79.25,9.75 80.06,10.57 80.06,13.61 80.67,14.22 81.89,14.22 82.5,13.61 82.5,10.16 84.94,7.72 R3.1 | SV2.1 18.49,3.66 19.3,3.66 20.52,2.44 39.22,2.44 41.86,5.08 41.86,5.28 42.67,6.1 46.13,6.1 46.94,5.28 46.94,2.44 48.16,1.22 53.44,1.22 54.66,2.44 54.66,5.28 56.9,7.52 58.32,7.52 R1.1 | v79.65,52.22 86.56,59.13
INT
  Bottom 0.203: SV1.32 5.08,40.64 6.71,40.64 9.14,43.08 28.25,43.08 29.26,44.09 29.26,44.3 30.48,45.52 32.51,45.52 34.14,47.14 34.14,60.35 34.54,60.76 47.75,60.76 51.61,64.62 53.24,64.62 IC1.5
IORQ  (via drill 0.3)
  Top 0.203: v1.83,32.31 0.41,33.73 0.41,77.01 4.06,80.67 49.99,80.67 56.08,74.57 56.08,67.46 60.96,62.59 64.62,62.59 66.65,64.62 68.48,64.62 IC1.36
  Bottom 0.203: v1.83,32.31 1.83,31.09 3.66,29.26 SV1.40
M1
  Top 0.203: IC1.8 53.24,57.1 51.82,57.1 47.95,53.24 36.78,53.24 34.14,50.6 30.48,50.6 29.67,49.78 29.67,47.14 28.45,45.92 7.92,45.92 6.5,44.5 SV1.27
MEMRD  (via drill 0.3)
  Top 0.203: 44.91,65.02 45.11,64.82 45.11,61.57 IC3.22 | 44.91,65.02 38.2,71.73 37.8,71.73 37.39,71.32 37.39,61.98 33.93,58.52 30.07,58.52 29.06,59.54 27.43,59.54 IC2.22 | v86.16,41.05 92.86,34.34 95.1,34.34 SV3.36 | v86.16,47.35 71.93,61.57 v71.53,61.57 | v50.39,68.48 47.75,65.84 45.72,65.84 44.91,65.02
  Bottom 0.203: v86.16,47.35 v86.16,41.05 | v71.53,61.57 69.49,63.6 65.23,63.6 60.35,68.48 v50.39,68.48
MEMWR  (via drill 0.3)
  Top 0.203: v85.34,41.05 94.49,31.9 95.1,31.9 SV3.38 | v74.98,62.79 v85.34,52.43
  Bottom 0.203: IC2.27 27.43,72.34 29.46,72.34 30.89,70.92 37.39,70.92 37.8,70.51 45.11,70.51 IC3.27 47.14,72.34 48.16,71.32 58.12,71.32 60.76,68.68 69.49,68.68 74.98,63.2 v74.98,62.79 | v85.34,52.43 v85.34,41.05
PIO0A0  (via drill 0.3)
  Top 0.203: v71.73,55.68 52.02,55.68 51.41,55.07 51.41,54.25 52.43,53.24 54.46,53.24 57.51,50.19 v57.51,28.25 | v57.51,18.29 43.08,3.86 SV12.1
  Bottom 0.203: v71.73,55.68 78.44,62.38 78.44,63.8 81.08,66.45 81.08,71.73 86.77,77.42 95.1,77.42 SV3.2 | v57.51,18.29 v57.51,28.25
PIO0A1
  Bottom 0.203: SV3.1 97.74,77.62 97.33,77.62 94.69,80.26 3.66,80.26 0.81,77.42 0.81,11.99 11.18,1.63 43.69,1.63 45.72,3.66 SV12.2
PIO0A2  (via drill 0.3)
  Top 0.203: v63.2,44.7 v63.2,47.35
  Bottom 0.203: v63.2,47.35 63.2,48.97 67.46,53.24 70.31,53.24 78.84,61.77 78.84,63.6 81.48,66.24 81.48,71.53 84.73,74.78 95.1,74.78 SV3.4 | v63.2,44.7 56.9,38.41 56.9,10.16 52.02,5.28 52.02,2.23 51.41,1.63 50.19,1.63 48.16,3.66 SV12.3
PIO0A3
  Bottom 0.203: SV12.4 50.8,4.67 56.49,10.36 56.49,39.83 67.26,50.6 69.49,50.6 79.25,60.35 79.25,63.4 81.89,66.04 81.89,71.32 84.12,73.56 95.5,73.56 96.72,74.78 97.74,74.78 SV3.3
PIO0A4  (via drill 0.3)
  Top 0.203: v61.98,64.21 61.57,64.62 61.57,67.67 67.46,73.56 83.52,73.56 84.53,72.54 95.1,72.54 SV3.6 | v59.94,27.03 v59.94,44.7
  Bottom 0.203: v61.98,64.21 61.98,64.01 62.18,63.8 62.18,46.94 v59.94,44.7 | v59.94,27.03 59.94,11.18 53.44,4.67 53.44,3.86 SV12.5
PIO0A5  (via drill 0.3)
  Top 0.203: v70.51,54.25 69.49,53.24 67.46,53.24 61.16,46.94 v61.16,40.84
  Bottom 0.203: v70.51,54.25 70.51,55.27 78.03,62.79 78.03,75.79 82.09,79.86 94.49,79.86 96.52,77.83 96.52,77.01 97.33,76.2 98.15,76.2 98.96,75.39 98.96,74.37 97.94,73.36 97.94,72.54 SV3.5 | v61.16,40.84 61.16,22.76 60.35,21.95 60.35,7.92 58.52,6.1 57.91,6.1 55.88,4.06 SV12.6
PIO0A6  (via drill 0.3)
  Top 0.203: v92.05,54.46 92.05,65.84 95.1,68.89 95.1,69.7 SV3.8 | v67.26,19.51 v70.1,22.35 | v64.41,16.66 64.41,15.24 57.3,8.13 57.3,4.88 58.32,3.86 SV12.7
  Bottom 0.203: v92.05,54.46 93.27,53.24 93.27,51.82 87.17,45.72 87.17,39.42 v70.1,22.35 | v64.41,16.66 v67.26,19.51
PIO0A7  (via drill 0.3)
  Top 0.203: v77.42,74.17 83.52,74.17 83.92,73.76 95.5,73.76 96.52,72.75 96.52,71.93 97.74,70.71 97.74,69.9 SV3.7 | v75.59,61.16 75.59,59.54 v82.7,52.43 | v63.6,26.01 63.6,17.27 54.66,8.33 54.66,2.23 55.27,1.63 58.93,1.63 60.96,3.66 SV12.8
  Bottom 0.203: v77.42,74.17 77.42,62.99 v75.59,61.16 | v82.7,52.43 82.7,41.05 69.7,28.04 66.85,28.04 66.45,28.45 66.04,28.45 v63.6,26.01
PIO0ARDY  (via drill 0.3)
  Top 0.203: v92.66,53.03 92.66,64.41 95.1,66.85 95.1,67.26 SV3.10 | v65.23,22.35 65.23,8.33 63.6,6.71 63.6,3.86 SV12.9
  Bottom 0.203: v92.66,53.03 92.66,51.82 86.77,45.92 86.77,40.84 68.28,22.35 v65.23,22.35
PIO0ASTB
  Top 0.203: SV12.10 R1.2
  Bottom 0.203: SV3.9 97.74,67.26 96.93,67.26 95.71,66.04 85.14,66.04 84.73,66.45 82.91,66.45 79.65,63.2 79.65,58.32 69.49,48.16 67.46,48.16 61.77,42.47 61.77,40.64 61.57,40.44 61.57,22.55 61.37,22.35 61.37,12.39 66.04,7.72 R1.2
PIO0B0  (via drill 0.3)
  Top 0.203: v66.85,45.92 66.24,45.31 v66.24,27.84 | v65.63,23.98 65.63,22.76 65.84,22.55 65.84,9.35 69.7,5.49 69.7,3.86 SV13.1
  Bottom 0.203: v66.85,45.92 69.9,45.92 80.06,56.08 80.06,62.99 83.11,66.04 84.53,66.04 85.75,64.82 95.1,64.82 SV3.12 | v66.24,27.84 66.24,24.59 v65.63,23.98
PIO0B1
  Bottom 0.203: SV3.11 97.74,64.62 96.72,64.62 95.71,63.6 86.36,63.6 84.33,65.63 83.31,65.63 80.67,62.99 80.67,56.08 70.1,45.52 67.26,45.52 61.98,40.23 61.98,22.35 61.77,22.15 61.77,17.88 69.09,10.57 69.09,7.92 72.34,4.67 72.34,3.86 SV13.2
PIO0B2  (via drill 0.3)
  Top 0.203: v94.28,56.29 94.08,56.49 94.08,60.15 95.1,61.16 95.1,62.18 SV3.14 | v84.73,50.39 v90.42,56.08 | v64.41,22.35 64.41,17.48 63.6,16.66 v63.6,15.24
  Bottom 0.203: v94.28,56.29 90.63,56.29 v90.42,56.08 | v84.73,50.39 84.73,40.44 67.26,22.96 65.02,22.96 v64.41,22.35 | v63.6,15.24 63.6,12.8 71.12,5.28 71.12,2.44 71.93,1.63 72.95,1.63 74.98,3.66 SV13.3
PIO0B3
  Top 0.203: SV3.13 97.74,62.18 97.74,61.37 96.52,60.15 96.52,56.69 97.33,55.88 98.15,55.88 100.38,53.65 100.38,11.38 98.15,9.14 82.7,9.14 77.42,3.86 SV13.4
PIO0B4
  Bottom 0.203: SV3.16 95.3,59.54 96.32,59.54 97.54,58.32 98.35,58.32 100.79,55.88 100.79,9.55 94.08,2.85 94.08,2.44 92.86,1.22 82.5,1.22 80.06,3.66 SV13.5
PIO0B5
  Top 0.203: SV3.15 97.94,59.54 97.94,58.73 100.79,55.88 100.79,11.18 98.35,8.74 87.78,8.74 85.14,6.1 84.73,6.1 82.5,3.86 SV13.6
PIO0B6
  Bottom 0.203: SV3.18 95.1,57.3 92.05,57.3 84.12,65.23 83.52,65.23 82.7,64.41 82.7,55.88 79.65,52.83 79.25,52.83 69.49,43.08 67.46,43.08 62.38,38 62.38,22.15 62.18,21.95 62.18,18.09 69.49,10.77 69.49,10.36 73.76,6.1 82.91,6.1 85.14,3.86 SV13.7
PIO0B7  (via drill 0.3)
  Top 0.203: v99.36,23.37 99.36,23.16 99.57,22.96 99.57,11.99 v99.16,11.58
  Bottom 0.203: v99.36,23.37 99.36,47.14 98.35,48.16 97.54,48.16 96.52,49.17 96.52,52.43 95.71,53.24 94.89,53.24 94.08,54.05 94.08,55.07 94.89,55.88 95.71,55.88 96.93,57.1 97.74,57.1 SV3.17 | v99.16,11.58 94.08,6.5 90.22,6.5 87.58,3.86 SV13.8
PIO0BRDY
  Bottom 0.203: SV3.20 95.3,54.46 96.32,54.46 97.54,53.24 98.35,53.24 100.38,51.21 100.38,11.99 94.49,6.1 92.25,6.1 90.02,3.86 SV13.9
PIO0BSTB  (via drill 0.3)
  Top 0.203: R3.2 92.66,7.52 92.66,3.86 SV13.10 | v99.77,47.55 99.77,51.82 97.94,53.65 97.94,54.46 SV3.19
  Bottom 0.203: v99.77,47.55 99.77,23.77 99.97,23.57 99.97,17.48 98.35,15.85 94.69,15.85 90.22,11.38 90.22,9.55 86.36,5.69 86.36,2.44 87.17,1.63 90.63,1.63 92.66,3.66 SV13.10
RAM2  (via drill 0.3)
  Top 0.203: v33.53,60.55 33.53,61.16 v34.14,61.77 | v60.15,64.21 61.37,62.99 64.41,62.99 67.67,66.24 78.64,66.24 80.26,67.87 82.91,67.87 91.44,59.33 91.44,53.44 93.47,51.41 v93.67,51.41
  Bottom 0.203: v33.53,60.55 33.53,59.13 32.92,58.52 30.89,58.52 27.43,55.07 27.43,54.66 IC2.20 | v34.14,61.77 44.3,61.77 46.13,63.6 49.78,63.6 52.02,65.84 58.52,65.84 v60.15,64.21 | v93.67,51.41 93.67,51 95.1,49.58 SV3.24
RAM3
  Top 0.203: SV3.23 96.52,50.8 93.47,50.8 91.03,53.24 91.03,56.29 90.02,57.3 89.61,57.3 87.38,55.07 83.52,55.07 75.18,63.4 67.46,63.4 65.23,61.16 52.02,61.16 51.82,61.37 49.58,61.37 48.97,60.76 48.97,56.9 47.14,55.07 47.14,54.66 IC3.20
RD
  Top 0.203: SV1.39 5.08,30.48 5.08,32.11 5.89,32.92 6.91,32.92 23.37,16.46 23.37,6.5 SV2.6
  Bottom 0.203: SV1.39 5.08,30.48 5.08,32.11 4.27,32.92 3.45,32.92 1.83,34.54 1.83,42.88 2.03,43.08 2.03,45.52 1.42,46.13 1.42,77.42 3.05,79.05 13.21,79.05 26.01,66.24 61.98,66.24 67.06,61.16 69.49,61.16 70.51,60.15 70.51,56.49 68.68,54.66 IC1.32
RESET  (via drill 0.3)
  Top 0.203: v62.99,23.37 59.94,23.37 50.19,13.61 | 50.19,13.61 40.03,3.45 40.03,3.25 38.81,2.03 25.2,2.03 23.57,3.66 SV2.5 | 50.19,13.61 38.41,25.4 38.41,26.42 34.54,30.28 34.14,30.28 33.73,29.87 33.73,29.67 24.79,20.73 24.38,20.73 23.98,21.13 23.98,25.4 14.83,34.54 14.43,34.54 7.11,41.86 6.5,41.86 SV1.29
  Bottom 0.203: v62.99,23.37 65.84,23.37 68.48,26.01 68.48,26.62 IC1.21
RTSA
  Bottom 0.203: IC1.17 53.24,34.14 44.91,34.14 33.93,23.16 8.53,23.16 6.3,20.93 4.47,20.93 3.25,19.71 SV14.3
RTSB
  Top 0.203: IC1.24 68.68,34.14 74.17,34.14 86.77,21.54 93.27,21.54 95.1,19.71 SV15.3
RXCA  (via drill 0.3)
  Top 0.203: IC1.13 53.44,44.3 53.44,42.06 IC1.14 53.24,41.86 51.41,40.03 51.41,36.17 48.97,33.73 | v24.59,21.34 33.93,30.68 34.75,30.68 38.81,26.62 38.81,25.6 39.62,24.79 40.03,24.79 48.97,33.73 | v62.99,28.85 62.59,28.85 60.15,26.42 58.52,26.42 54.25,30.68 52.02,30.68 48.97,33.73
  Bottom 0.203: v24.59,21.34 17.88,14.63 5.89,14.63 SV14.8 | v62.99,28.85 64.41,30.28 70.31,30.28 75.79,35.76 75.79,39.83 76.61,40.64 76.81,40.64 78.03,41.86 SV5.2
RXDA
  Bottom 0.203: IC1.12 53.24,46.94 49.17,42.88 49.17,39.62 33.53,23.98 4.88,23.98 3.25,22.35 SV14.1
RXDB
  Top 0.203: IC1.28 68.68,44.3 71.12,41.86 71.12,38.41 87.17,22.35 95.1,22.35 SV15.1
RXTXCB
  Top 0.203: SV15.8 97.94,14.63 97.94,15.44 99.16,16.66 99.16,22.76 83.92,38 72.34,38 71.53,38.81 71.53,40.03 73.56,42.06 SV7.2
  Bottom 0.203: IC1.27 68.68,41.86 73.56,41.86 SV7.2
SEL03  (via drill 0.3)
  Top 0.203: v47.55,6.5 v62.79,21.74 | v36.98,5.08 35.56,5.08 34.95,4.47 34.95,3.25 34.14,2.44 30.68,2.44 29.87,3.25 29.87,4.27 29.06,5.08 27.43,5.08 26.21,6.3 SV2.8
  Bottom 0.203: v62.79,21.74 70.31,21.74 94.28,45.72 95.71,45.72 96.93,46.94 97.74,46.94 SV3.25 | v47.55,6.5 40.64,6.5 39.22,5.08 v36.98,5.08
SIO0
  Top 0.203: IC1.35 68.68,62.18 72.14,62.18 87.17,47.14 95.1,47.14 SV3.26
TO0
  Top 0.203: SV3.30 95.1,42.06 80.67,42.06 78.23,44.5 SV5.3 78.03,44.5 76.81,45.72 67.46,45.72 66.65,44.91 66.65,28.85 67.46,28.04 70.51,28.04 86.36,12.19 SV10.2
TO1
  Top 0.203: SV3.32 95.1,39.42 88.59,39.42 86.36,41.66 80.67,41.66 79.65,40.64 76.61,40.64 75.79,41.45 75.79,42.47 73.76,44.5 SV7.3
  Bottom 0.203: SV10.4 81.28,11.18 79.45,9.35 71.12,9.35 69.9,10.57 69.9,14.02 SV3.32
TO2
  Bottom 0.203: SV10.6 76.2,17.48 95.1,36.37 95.1,36.78 SV3.34
TRG0
  Top 0.203: SV3.29 97.94,41.86 97.94,40.84 99.97,38.81 99.97,11.58 99.16,10.77 90.22,10.77 89,11.99 SV10.1
TRG1
  Bottom 0.203: SV3.31 97.94,39.22 97.94,38.41 98.96,37.39 98.96,27.84 83.92,12.8 83.92,12.19 SV10.3
TRG2
  Bottom 0.203: SV3.33 97.74,36.78 96.93,36.78 95.71,35.56 94.89,35.56 78.64,19.3 78.64,12.19 SV10.5
TRG3  (via drill 0.3)
  Top 0.203: v79.25,17.88 73.56,12.19 SV10.7
  Bottom 0.203: v79.25,17.88 94.28,32.92 95.5,32.92 96.72,34.14 97.74,34.14 SV3.35
TXDA
  Bottom 0.203: IC1.15 53.24,39.22 49.38,39.22 33.73,23.57 7.11,23.57 5.89,22.35 SV14.2
TXDB  (via drill 0.3)
  Top 0.203: v74.78,35.56 84.53,35.56 97.74,22.35 SV15.2
  Bottom 0.203: v74.78,35.56 71.12,39.22 68.68,39.22 IC1.26
VCC
  Top 0.203: C9.+ 9.75,32.51 6.71,35.56 5.89,35.56 5.08,34.75 5.08,33.93 4.06,32.92 3.25,32.92 1.83,31.5 1.83,15.85 3.05,14.63 SV14.7 3.25,14.43 4.47,13.21 4.47,11.58 13.61,2.44 18.9,2.44 20.12,3.66 20.93,3.66 SV2.3 | SV3.21 97.74,52.22 96.72,52.22 95.5,53.44 94.69,53.44 93.67,54.46 93.67,64.82 94.89,66.04 95.71,66.04 96.52,66.85 96.52,70.31 95.71,71.12 84.53,71.12 84.12,70.71 77.22,70.71 76.2,71.73 Y1.8 | 48.77,71.93 47.14,70.31 47.14,69.9 IC3.26 | 48.77,71.93 48.77,73.15 IC3.28 43.28,78.64 41.45,78.64 C3.1 | SV15.7 95.1,14.43 88.59,14.43 87.58,13.41 87.58,10.57 86.77,9.75 70.71,9.75 66.24,14.22 66.24,26.42 60.55,32.11 60.55,47.75 53.85,54.46 53.44,54.46 IC1.9 | 48.77,71.93 51.41,71.93 52.43,70.92 54.66,70.92 55.27,70.31 55.27,64.21 53.44,62.38 IC1.6 | SV1.22 3.86,52.22 3.86,53.03 5.08,54.25 5.08,62.59 4.06,63.6 3.25,63.6 2.64,64.21 2.64,75.39 3.45,76.2 19.1,76.2 21.54,78.64 C2.1
  Bottom 0.203: SV1.22 3.66,52.02 3.66,51 2.44,49.78 2.44,42.88 2.23,42.67 2.23,36.78 3.45,35.56 12.39,35.56 14.02,37.19 15.24,37.19 15.85,36.58 15.85,33.73 14.63,32.51 C9.+ | 76.2,77.42 Y1.8 | 76.2,77.42 77.42,78.64 C4.1 | 26.42,73.97 27.23,74.78 IC2.28 27.43,74.98 29.46,74.98 32.11,77.62 40.23,77.62 41.25,78.64 C3.1 | 26.42,73.97 25.4,72.95 25.4,71.73 27.23,69.9 IC2.26 | 26.42,73.97 21.74,78.64 C2.1 | IC3.28 47.14,74.98 50.8,78.64 57.71,78.64 C1.1 57.91,78.64 59.13,77.42 76.2,77.42 | R2.2 50.19,52.83 51.21,52.83 52.83,54.46 53.24,54.46 IC1.9 53.44,54.66 55.27,56.49 55.27,60.35 53.44,62.18 IC1.6
WR
  Top 0.203: SV1.37 6.5,31.7 6.5,30.68 19.71,17.48 19.71,5.69 20.32,5.08 24.79,5.08 26.01,3.86 SV2.7

### Text on the board
tNames: Z80 ESV1.0 EXP-BRD | CTC1/CTC0 | BAUD CLOCK | GND TRG3 TO2 TRG2 TO1 TRG1 TO0 TRGO | VCC DTRB RTSB RXDB / GND RXCB DCDB CTSB TXDA | GND RD SEL03 D0 D2 D4 D6 A1 / GND VCC RESET WR A0 D1 D3 D5 D7 | VCC DTRA RTSA RXDA / GND RXCA DCDA CTSA TXDA | D0 D1 D2 D3 D4 D5 D6 D7 RDY STB | D0 D1 D2 D3 D4 D5 D6 D7 RDY STB